# EAGLE schematic gambaran rev1 (EAGLE 9.1.3)
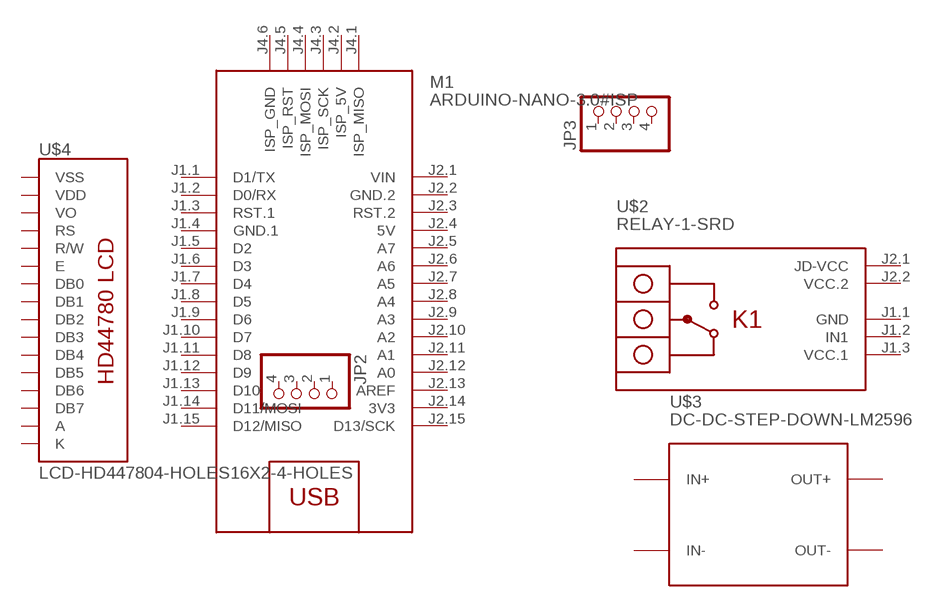
[diagram p0: schematic, sheet 1]

## Parts
JP2  PINHD-1X4/90  [1X04/90]
JP3  PINHD-1X4/90  [1X04/90]
M1  ARDUINO-NANO-3.0#ISP  [ARDUINO-NANO-3.0#ISP]
U$2  RELAY-1-SRD  [RELAY-1-SRD]
U$3  DC-DC-STEP-DOWN-LM2596  [DC-DC-STEP-DOWN-LM2596]
U$4  LCD-HD447804-HOLES16X2-4-HOLES  [LCD-16X2-4HOLES]
Unconnected: JP2.1 JP2.2 JP2.3 JP2.4 JP3.1 JP3.2 JP3.3 JP3.4 M1.J1.1(D1/TX) M1.J1.2(D0/RX) M1.J1.3(RST.1) M1.J1.5(D2) M1.J1.6(D3) M1.J1.7(D4) M1.J1.8(D5) M1.J1.9(D6) M1.J1.10(D7) M1.J1.11(D8) M1.J1.12(D9) M1.J1.13(D10) M1.J1.14(D11/MOSI) M1.J1.15(D12/MISO) M1.J2.3(RST.2) M1.J2.5(A7) M1.J2.6(A6) M1.J2.7(A5) M1.J2.8(A4) M1.J2.9(A3) M1.J2.10(A2) M1.J2.11(A1) M1.J2.12(A0) M1.J2.13(AREF) M1.J2.15(D13/SCK) M1.J4.1(ISP_MISO) M1.J4.2(ISP_5V) M1.J4.3(ISP_SCK) M1.J4.4(ISP_MOSI) M1.J4.5(ISP_RST) M1.J4.6(ISP_GND) U$2.J1.2(IN1) U$2.J2.1(JD-VCC) U$3.IN+ U$3.IN- U$3.OUT+ U$3.OUT- U$4.3(VO) U$4.4(RS) U$4.5(R/W) U$4.6(E) U$4.7(DB0) U$4.8(DB1) U$4.9(DB2) U$4.10(DB3) U$4.11(DB4) U$4.12(DB5) U$4.13(DB6) U$4.14(DB7)

## Power pins joined to a net without a drawn wire
3V3: M1.J2.14(3V3)
5V: M1.J2.4(5V)
A: U$4.15(A)
GND: U$2.J1.1(GND)
GND.1: M1.J1.4(GND.1)
GND.2: M1.J2.2(GND.2)
K: U$4.16(K)
VCC.1: U$2.J1.3(VCC.1)
VCC.2: U$2.J2.2(VCC.2)
VDD: U$4.2(VDD)
VIN: M1.J2.1(VIN)
VSS: U$4.1(VSS)

## Library data of the parts
JP2 JP3 = pinhead:PINHD-1X4: PIN HEADER
M1 = diy-modules:ARDUINO-NANO-3.0#ISP: Arduino Nano 3.0 (and compatible devices) with ISP pads More details available here: https://www.arduino.cc/en/Main/ArduinoBoardNano Click here to find device on ebay.com <http://www.ebay.com/sch/arduino+nano>
U$2 = diy-modules:RELAY-1-SRD: 1-Channel Relay Module based on SRD-05VDC-SL-C relays Click here to find device on ebay.com <http://www.ebay.com/sch/one+channel+isolated+relay+5v>
U$3 = diy-modules:DC-DC-STEP-DOWN-LM2596: DC/DC Step-Down Regulator based on LM2596-ADJ chip LM2596 datasheet available here: http://www.ti.com/lit/ds/symlink/lm2596.pdf Click here to find device on ebay.com <http://www.ebay.com/sch/lm2596+power+regulator>
U$4 = LCD:LCD-HD44780